# EAGLE schematic PDU_breakout (EAGLE 9.7.0)
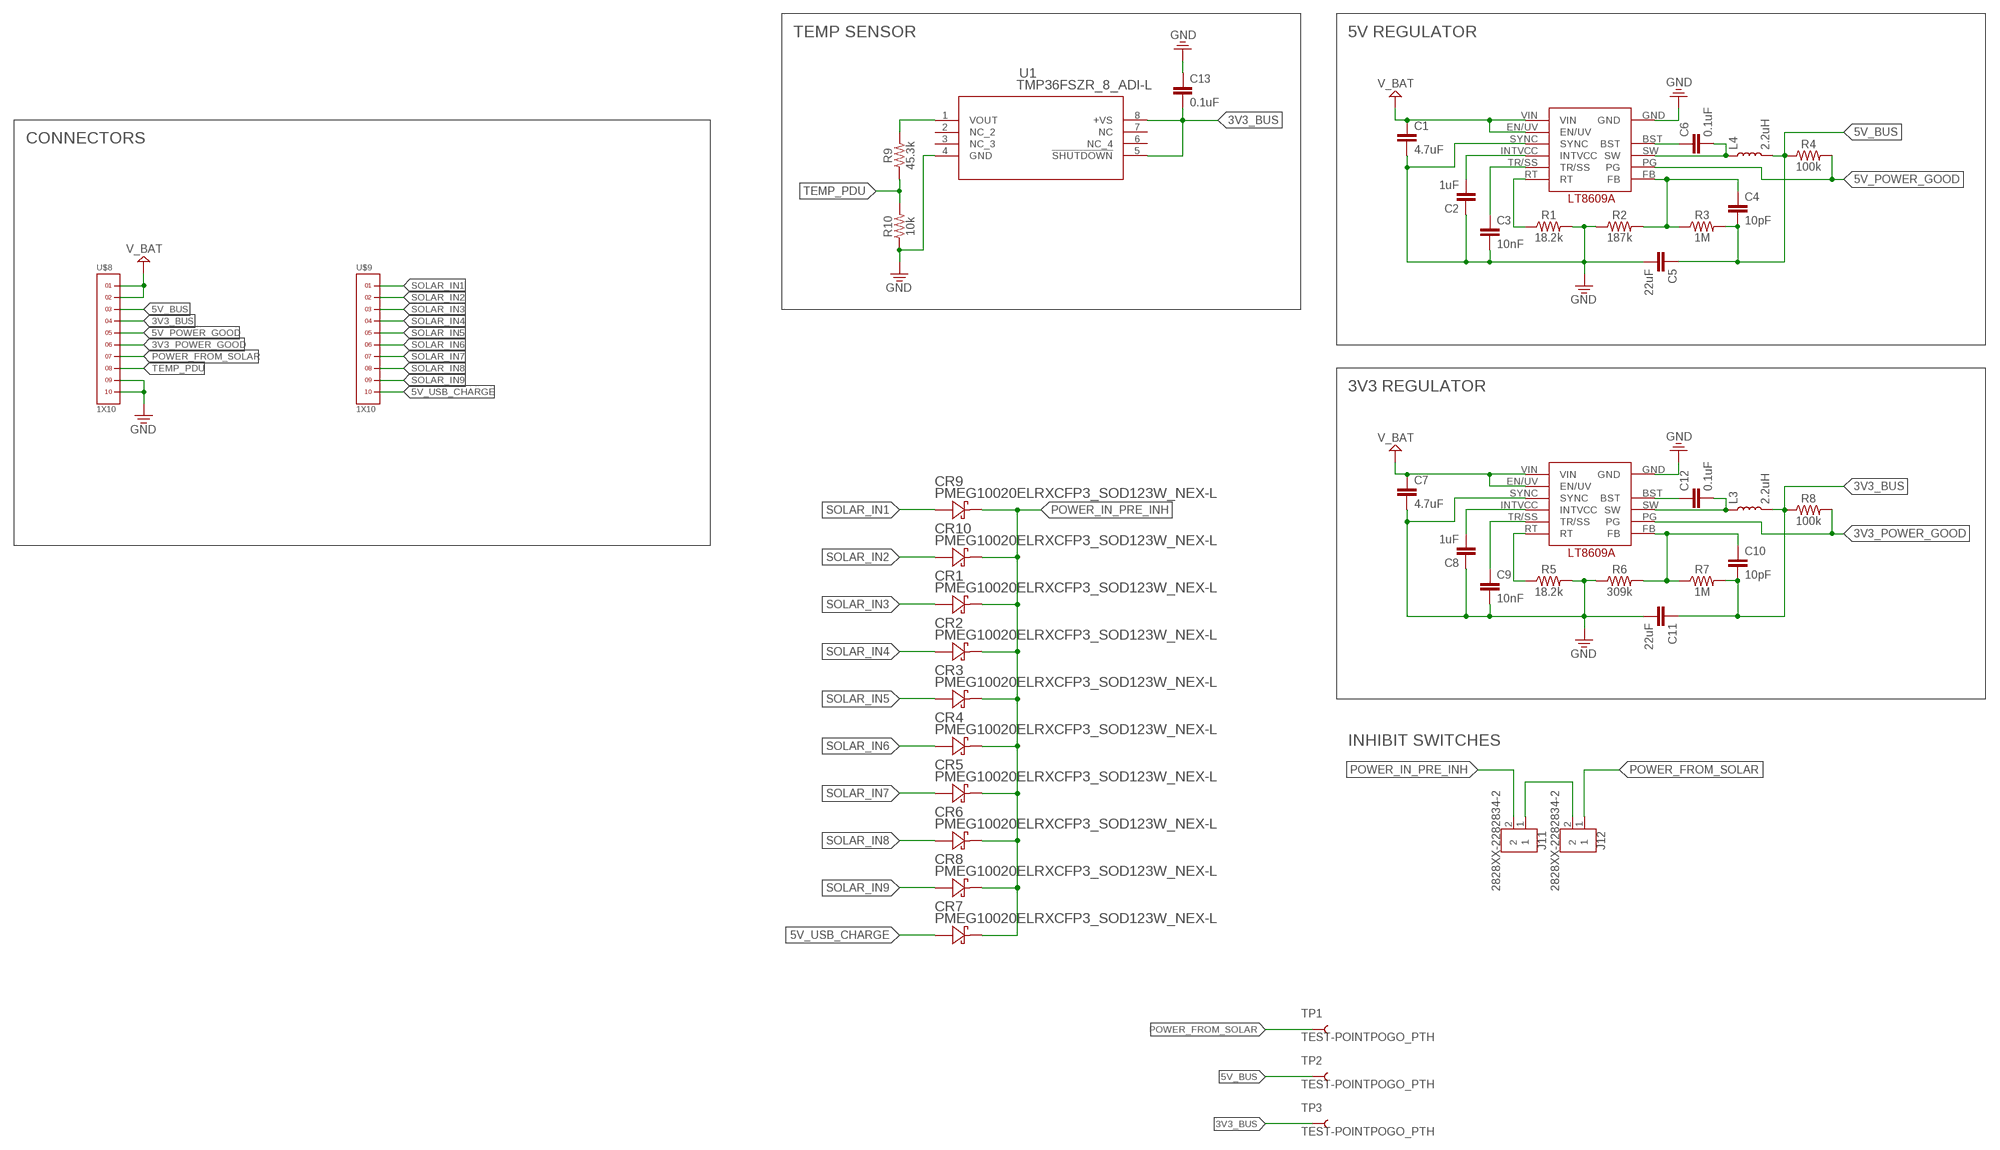
[diagram p0: schematic, sheet 1]

## Parts
C1  4.7uF  2.2UF-0805-25V-(+80/-20%)  [0805]
C2  1uF  2.2UF-0805-25V-(+80/-20%)  [0805]
C3  10nF  2.2UF-0805-25V-(+80/-20%)  [0805]
C4  10pF  2.2UF-0805-25V-(+80/-20%)  [0805]
C5  22uF  2.2UF-0805-25V-(+80/-20%)  [0805]
C6  0.1uF  2.2UF-0805-25V-(+80/-20%)  [0805]
C7  4.7uF  2.2UF-0805-25V-(+80/-20%)  [0805]
C8  1uF  2.2UF-0805-25V-(+80/-20%)  [0805]
C9  10nF  2.2UF-0805-25V-(+80/-20%)  [0805]
C10  10pF  2.2UF-0805-25V-(+80/-20%)  [0805]
C11  22uF  2.2UF-0805-25V-(+80/-20%)  [0805]
C12  0.1uF  2.2UF-0805-25V-(+80/-20%)  [0805]
C13  0.1uF  2.2UF-0805-25V-(+80/-20%)  [0805]
CR1  PMEG10020ELRXCFP3_SOD123W_NEX-L  [CFP3_SOD123W_NEX-L]
CR2  PMEG10020ELRXCFP3_SOD123W_NEX-L  [CFP3_SOD123W_NEX-L]
CR3  PMEG10020ELRXCFP3_SOD123W_NEX-L  [CFP3_SOD123W_NEX-L]
CR4  PMEG10020ELRXCFP3_SOD123W_NEX-L  [CFP3_SOD123W_NEX-L]
CR5  PMEG10020ELRXCFP3_SOD123W_NEX-L  [CFP3_SOD123W_NEX-L]
CR6  PMEG10020ELRXCFP3_SOD123W_NEX-L  [CFP3_SOD123W_NEX-L]
CR7  PMEG10020ELRXCFP3_SOD123W_NEX-L  [CFP3_SOD123W_NEX-L]
CR8  PMEG10020ELRXCFP3_SOD123W_NEX-L  [CFP3_SOD123W_NEX-L]
CR9  PMEG10020ELRXCFP3_SOD123W_NEX-L  [CFP3_SOD123W_NEX-L]
CR10  PMEG10020ELRXCFP3_SOD123W_NEX-L  [CFP3_SOD123W_NEX-L]
J11  2828XX-2282834-2  [TERMBLK_254-2N]
J12  2828XX-2282834-2  [TERMBLK_254-2N]
L3  2.2uH  INDUCTOR-XFL40201.5UH  [XFL4020]
L4  2.2uH  INDUCTOR-XFL40201.5UH  [XFL4020]
R1  18.2k  0.75OHM-0805-1/4W-1%  [0805]
R2  187k  0.75OHM-0805-1/4W-1%  [0805]
R3  1M  0.75OHM-0805-1/4W-1%  [0805]
R4  100k  0.75OHM-0805-1/4W-1%  [0805]
R5  18.2k  0.75OHM-0805-1/4W-1%  [0805]
R6  309k  0.75OHM-0805-1/4W-1%  [0805]
R7  1M  0.75OHM-0805-1/4W-1%  [0805]
R8  100k  0.75OHM-0805-1/4W-1%  [0805]
R9  45.3k  0.75OHM-0805-1/4W-1%  [0805]
R10  10k  0.75OHM-0805-1/4W-1%  [0805]
TP1  TEST-POINTPOGO_PTH  [1X01_NO_SILK]
TP2  TEST-POINTPOGO_PTH  [1X01_NO_SILK]
TP3  TEST-POINTPOGO_PTH  [1X01_NO_SILK]
U1  TMP36FSZR_8_ADI-L  [R_8_ADI-L]
U$1  LT8609A-MSOP10  [LT8609A-MSE10]
U$2  LT8609A-MSOP10  [LT8609A-MSE10]
U$8  1X10  [1X10]
U$9  1X10  [1X10]

## Nets
3V3_BUS: C10.2 C11.1 C13.2 L3.P$2 R7.2 R8.1 TP3.1 U1.5(!SHUTDOWN) U1.8(+VS) U$8.4
3V3_POWER_GOOD: R8.2 U$2.PG U$8.6
5V_BUS: C4.2 C5.1 L4.P$2 R3.2 R4.1 TP2.1 U$8.3
5V_POWER_GOOD: R4.2 U$1.PG U$8.5
5V_USB_CHARGE: CR7.2 U$9.10
GND: C1.2 C2.1 C3.2 C5.2 C7.2 C8.1 C9.2 C11.2 C13.1 R1.2 R2.1 R5.2 R6.1 R10.1 U1.4(GND) U$1.GND U$1.SYNC U$2.GND U$2.SYNC U$8.9 U$8.10
N$1: C6.1 U$1.BST
N$2: C2.2 U$1.INTVCC
N$3: C3.1 U$1.TR/SS
N$4: R1.1 U$1.RT
N$5: C8.2 U$2.INTVCC
N$6: C4.1 R2.2 R3.1 U$1.FB
N$7: C6.2 L4.P$1 U$1.SW
N$8: C9.1 U$2.TR/SS
N$9: R5.1 U$2.RT
N$10: C10.1 R6.2 R7.1 U$2.FB
N$11: C12.1 U$2.BST
N$12: R9.2 U1.1(VOUT)
N$13: C12.2 L3.P$1 U$2.SW
N$15: J11.1 J12.2
POWER_FROM_SOLAR: J12.1 TP1.1 U$8.7
POWER_IN_PRE_INH: CR1.1 CR2.1 CR3.1 CR4.1 CR5.1 CR6.1 CR7.1 CR8.1 CR9.1 CR10.1 J11.2
SOLAR_IN1: CR9.2 U$9.1
SOLAR_IN2: CR10.2 U$9.2
SOLAR_IN3: CR1.2 U$9.3
SOLAR_IN4: CR2.2 U$9.4
SOLAR_IN5: CR3.2 U$9.5
SOLAR_IN6: CR4.2 U$9.6
SOLAR_IN7: CR5.2 U$9.7
SOLAR_IN8: CR6.2 U$9.8
SOLAR_IN9: CR8.2 U$9.9
TEMP_PDU: R9.1 R10.2 U$8.8
V_BAT: C1.1 C7.1 U$1.EN/UV U$1.VIN U$2.EN/UV U$2.VIN U$8.1 U$8.2
Unconnected: U1.2(NC_2) U1.3(NC_3) U1.6(NC_4) U1.7(NC)

## Notes on the sheet
- TEMP SENSOR | 5V REGULATOR
- CONNECTORS
- 3V3 REGULATOR
- INHIBIT SWITCHES

## Library data of the parts
C1-C13 = SparkFun-Capacitors:2.2UF: 2.2µF ceramic capacitors A capacitor is a passive two-terminal electrical component used to store electrical energy temporarily in an electric field.; PROD_ID: CAP-11624; VALUE: 2.2uF
CR1-CR10 = PDUv2:PMEG10020ELRX; BUILT_BY: EMA_Cory; COPYRIGHT: Copyright (C) 2018 Accelerated Designs. All rights reserved; DATASHEET: https://assets.nexperia.com/documents/data-sheet/PMEG10020ELR.pdf; MANUFACTURER_PART_NUMBER: PMEG10020ELRX; SOURCELIBRARY: Nexperia_2020-02-26; VENDOR: Nexperia
J11 J12 = Connector:2828XX-2: 2 Position Wire to Board Terminal Block Horizontal with Board Datasheet <https://www.te.com.cn/commerce/DocumentDelivery/DDEController?Action=showdoc&DocId=Catalog+Section%7F1308389_EUROSTYLE_TERMINAL_BLOCKS%7F0607%7Fpdf%7FEnglish%7FENG_CS_1308389_EUROSTYLE_TERMINAL_BLOCKS_0607.pdf%7F2-282837-5>; CATEGORY: Fixed Terminal Blocks; DESCRIPTION: Fixed Terminal Blocks 2P SIDE ENTRY 2.54mm; MANUFACTURER: TE Connectivity AMP Connectors; MPN: 282834-2; OPERATING_TEMPERATURE: -40°C ~ 105°C; PART_STATUS: Active; PITCH: 0.100" (2.54mm); ROHS_COMPLIANCE: RoHS Compliant; SERIES: Buchanan; SUBCATEGORY: Terminal Blocks; TYPE: Through Hole; Screw - Rising Cage Clamp; Side wire entry, Horizontal with Board
L3 L4 = SparkFun-Coils:INDUCTOR-XFL4020; PROD_ID: INDUC-13855; VALUE: 1.5uH
R1-R10 = SparkFun-Resistors:0.75OHM: 0.75Ω resistor A resistor is a passive two-terminal electrical component that implements electrical resistance as a circuit element. Resistors act to reduce current flow, and, at the same time, act to lower voltage levels within circuits. - Wikipedia; PROD_ID: RES-08474; VALUE: 0.75
TP1-TP3 = SparkFun-Connectors:TEST-POINT: SparkFun Test Points Bare copper test points for troubleshooting or In-Circuit-Testing. These are used by our Production team for verifying production board runs using pogo-pins on test beds. SparkFun Products: SparkFun LSM9DS1 Breakout <https://www.sparkfun.com/products/13284> SparkFun PSOC <https://www.sparkfun.com/products/13714> SparkFun Load Cell Amplifier <https://www.sparkfun.com/products/13879>
U1 = PDUv2:TMP36FSZ; COPYRIGHT: Copyright (C) 2021 Ultra Librarian. All rights reserved.; MANUFACTURER_PART_NUMBER: TMP36FSZ; MFR_NAME: Analog Devices Inc
U$1 U$2 = LT8609A:LT8609A-MSOP10
U$8 U$9 = headers(2mm):1X10